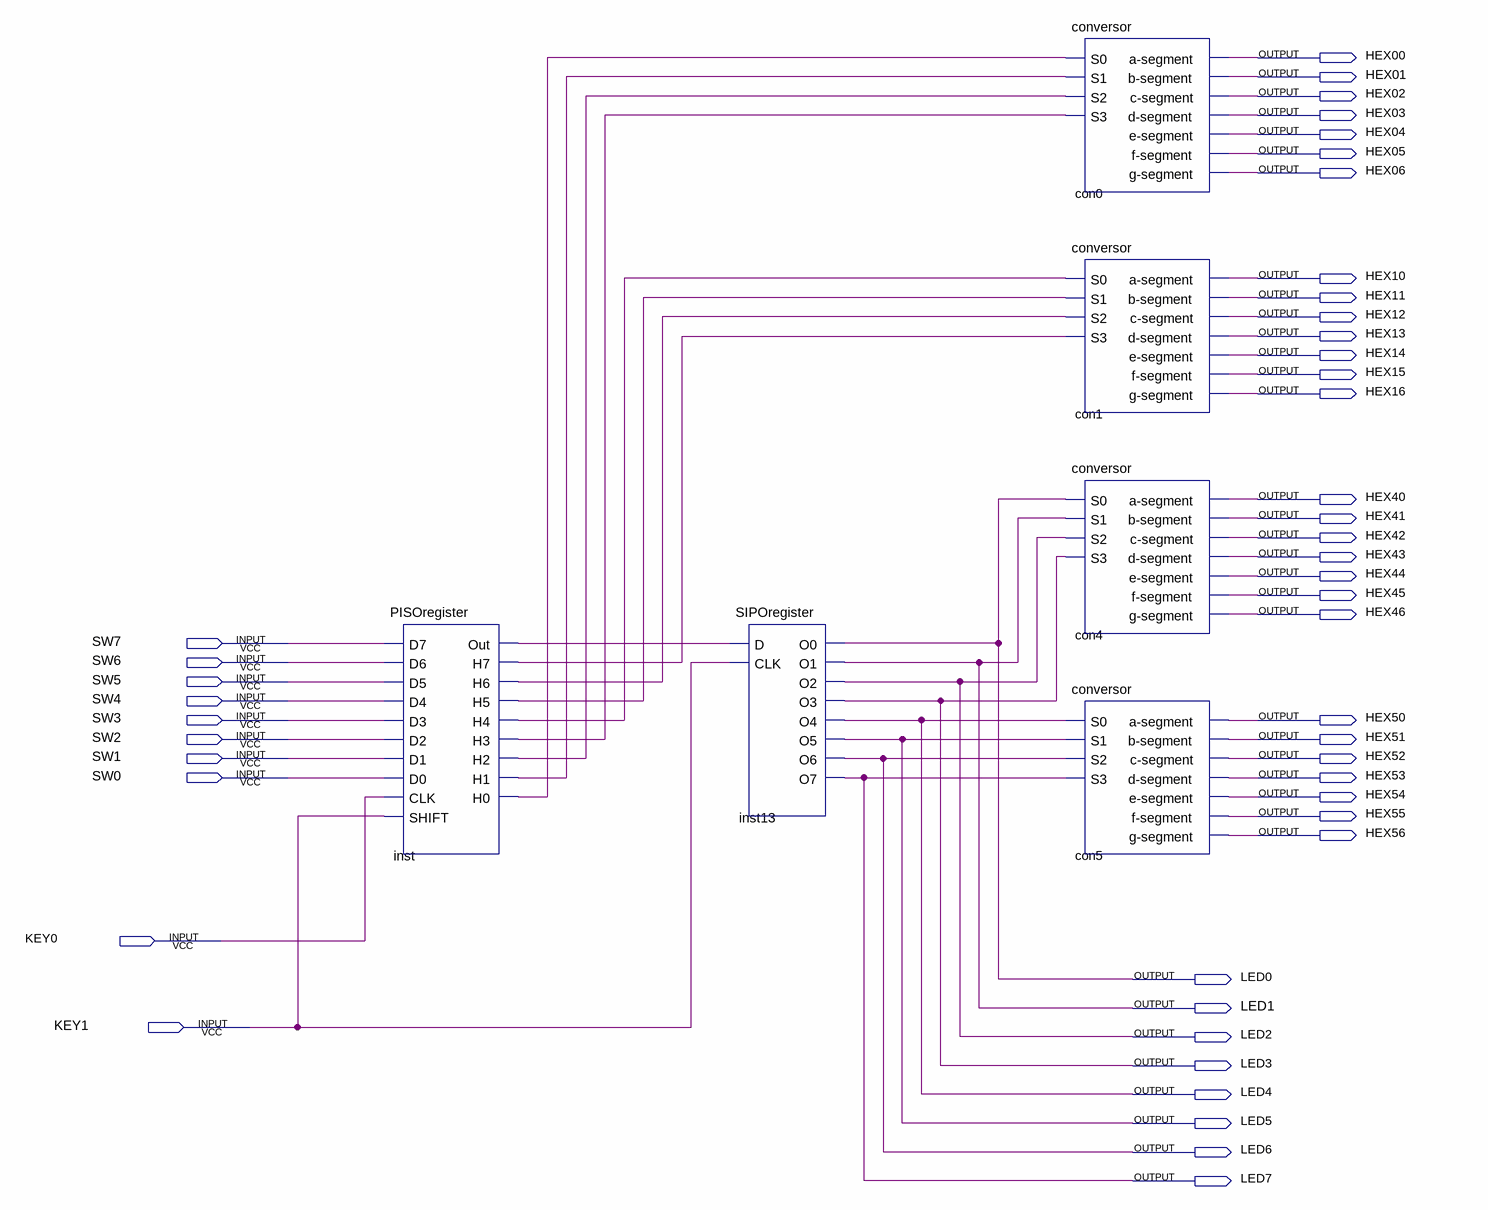
[diagram p0: schematic sheet]
// Quartus schematic sipo-piso-shift-registers.bdf as structural Verilog: 6 symbols, 46 pins
module \sipo-piso-shift-registers  (
  input  SW7,
  input  SW6,
  input  SW5,
  input  SW4,
  input  SW3,
  input  SW2,
  input  SW1,
  input  SW0,
  input  KEY0,
  input  KEY1,
  output HEX00,
  output HEX01,
  output HEX02,
  output HEX03,
  output HEX04,
  output HEX05,
  output HEX06,
  output HEX10,
  output HEX11,
  output HEX12,
  output HEX13,
  output HEX14,
  output HEX15,
  output HEX16,
  output HEX40,
  output HEX41,
  output HEX42,
  output HEX43,
  output HEX44,
  output HEX45,
  output HEX46,
  output HEX50,
  output HEX51,
  output HEX52,
  output HEX53,
  output HEX54,
  output HEX55,
  output HEX56,
  output LED0,
  output LED1,
  output LED2,
  output LED3,
  output LED4,
  output LED5,
  output LED6,
  output LED7
);

  wire inst_h0, inst_h1, inst_h2, inst_h3, inst_h4, inst_h5, inst_h6, inst_h7, inst_out;

  PISOregister inst (
    .D7(SW7), .D6(SW6), .D5(SW5), .D4(SW4), .D3(SW3), .D2(SW2), .D1(SW1), .D0(SW0), .CLK(KEY0), .SHIFT(KEY1),
    .Out(inst_out), .H7(inst_h7), .H6(inst_h6), .H5(inst_h5), .H4(inst_h4), .H3(inst_h3), .H2(inst_h2),
    .H1(inst_h1), .H0(inst_h0));
  SIPOregister inst13 (
    .D(inst_out), .CLK(KEY1), .O0(LED0), .O1(LED1), .O2(LED2), .O3(LED3), .O4(LED4), .O5(LED5), .O6(LED6),
    .O7(LED7));
  conversor con0 (
    .S0(inst_h0), .S1(inst_h1), .S2(inst_h2), .S3(inst_h3), .\a-segment (HEX00), .\b-segment (HEX01),
    .\c-segment (HEX02), .\d-segment (HEX03), .\e-segment (HEX04), .\f-segment (HEX05), .\g-segment (HEX06));
  conversor con1 (
    .S0(inst_h4), .S1(inst_h5), .S2(inst_h6), .S3(inst_h7), .\a-segment (HEX10), .\b-segment (HEX11),
    .\c-segment (HEX12), .\d-segment (HEX13), .\e-segment (HEX14), .\f-segment (HEX15), .\g-segment (HEX16));
  conversor con4 (
    .S0(LED0), .S1(LED1), .S2(LED2), .S3(LED3), .\a-segment (HEX40), .\b-segment (HEX41),
    .\c-segment (HEX42), .\d-segment (HEX43), .\e-segment (HEX44), .\f-segment (HEX45), .\g-segment (HEX46));
  conversor con5 (
    .S0(LED4), .S1(LED5), .S2(LED6), .S3(LED7), .\a-segment (HEX50), .\b-segment (HEX51),
    .\c-segment (HEX52), .\d-segment (HEX53), .\e-segment (HEX54), .\f-segment (HEX55), .\g-segment (HEX56));
endmodule
